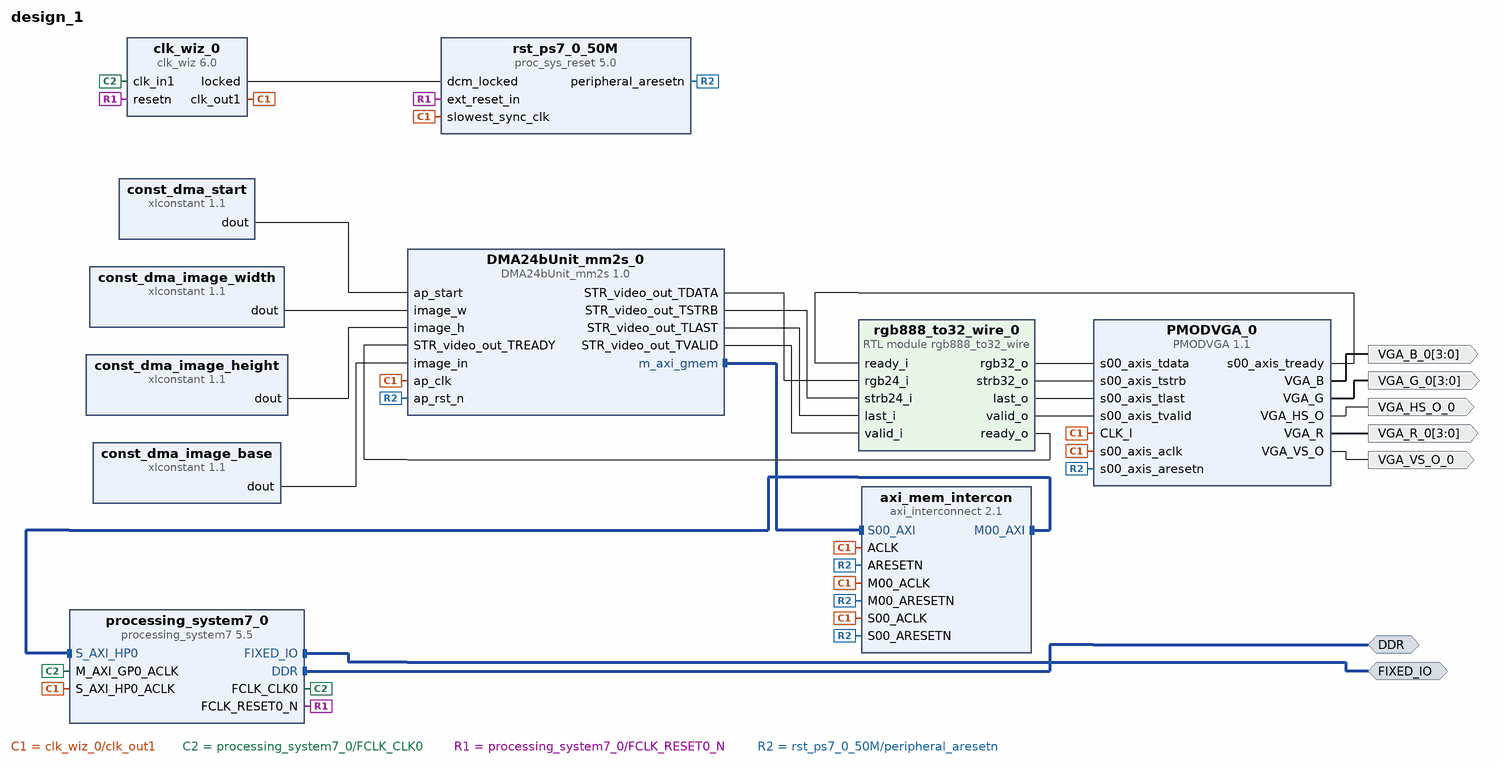
[diagram p0: block diagram of the top level]
# Vivado block design design_1, xc7z010clg400-3, Vivado 2020.2
create_bd_design design_1

create_bd_intf_port -mode Master -vlnv xilinx.com:interface:ddrx_rtl:1.0 DDR
create_bd_intf_port -mode Master -vlnv xilinx.com:display_processing_system7:fixedio_rtl:1.0 FIXED_IO
create_bd_port -dir O -from 3 -to 0 VGA_R_0
create_bd_port -dir O -from 3 -to 0 VGA_B_0
create_bd_port -dir O VGA_VS_O_0
create_bd_port -dir O VGA_HS_O_0
create_bd_port -dir O -from 3 -to 0 VGA_G_0

create_bd_cell -type ip -vlnv xilinx.com:hls:DMA24bUnit_mm2s:1.0 DMA24bUnit_mm2s_0
create_bd_cell -type ip -vlnv xilinx.com:ip:processing_system7:5.5 processing_system7_0
set_property -dict {CONFIG.PCW_CRYSTAL_PERIPHERAL_FREQMHZ 50.000 CONFIG.PCW_USE_S_AXI_HP0 1} [get_bd_cells processing_system7_0]
# 30 more settings of processing_system7_0 are not shown: defaults, MIO pin electricals, DDR timing, and values the tool derives
create_bd_cell -type ip -vlnv xilinx.com:ip:clk_wiz:6.0 clk_wiz_0
set_property -dict [list \
  CONFIG.AUTO_PRIMITIVE MMCM \
  CONFIG.CLKIN1_JITTER_PS 200.0 \
  CONFIG.CLKOUT1_DRIVES BUFG \
  CONFIG.CLKOUT1_JITTER 162.642 \
  CONFIG.CLKOUT1_PHASE_ERROR 141.876 \
  CONFIG.CLKOUT1_REQUESTED_OUT_FREQ 25.175 \
  CONFIG.CLKOUT2_DRIVES BUFG \
  CONFIG.CLKOUT3_DRIVES BUFG \
  CONFIG.CLKOUT4_DRIVES BUFG \
  CONFIG.CLKOUT5_DRIVES BUFG \
  CONFIG.CLKOUT6_DRIVES BUFG \
  CONFIG.CLKOUT7_DRIVES BUFG \
  CONFIG.MMCM_BANDWIDTH OPTIMIZED \
  CONFIG.MMCM_CLKFBOUT_MULT_F 27.125 \
  CONFIG.MMCM_CLKIN1_PERIOD 20.000 \
  CONFIG.MMCM_CLKIN2_PERIOD 10.0 \
  CONFIG.MMCM_CLKOUT0_DIVIDE_F 53.875 \
  CONFIG.MMCM_COMPENSATION INTERNAL \
  CONFIG.MMCM_DIVCLK_DIVIDE 1 \
  CONFIG.OVERRIDE_MMCM true \
  CONFIG.PLL_COMPENSATION SYSTEM_SYNCHRONOUS \
  CONFIG.PRIMITIVE MMCM \
  CONFIG.PRIM_IN_FREQ 50.000 \
  CONFIG.PRIM_IN_TIMEPERIOD 20.000 \
  CONFIG.PRIM_SOURCE No_buffer \
  CONFIG.RESET_PORT resetn \
  CONFIG.RESET_TYPE ACTIVE_LOW \
  CONFIG.USE_LOCKED true \
] [get_bd_cells clk_wiz_0]
create_bd_cell -type ip -vlnv xilinx.com:ip:proc_sys_reset:5.0 rst_ps7_0_50M
create_bd_cell -type ip -vlnv xilinx.com:ip:axi_interconnect:2.1 axi_mem_intercon
set_property -dict {CONFIG.NUM_MI 1} [get_bd_cells axi_mem_intercon]
create_bd_cell -type ip -vlnv xilinx.com:ip:xlconstant:1.1 const_dma_start
set_property -dict {CONFIG.CONST_VAL 1 CONFIG.CONST_WIDTH 1} [get_bd_cells const_dma_start]
create_bd_cell -type ip -vlnv xilinx.com:ip:xlconstant:1.1 const_dma_image_width
set_property -dict {CONFIG.CONST_VAL 640 CONFIG.CONST_WIDTH 12} [get_bd_cells const_dma_image_width]
create_bd_cell -type ip -vlnv xilinx.com:ip:xlconstant:1.1 const_dma_image_height
set_property -dict {CONFIG.CONST_VAL 480 CONFIG.CONST_WIDTH 12} [get_bd_cells const_dma_image_height]
create_bd_cell -type ip -vlnv xilinx.com:ip:xlconstant:1.1 const_dma_image_base
set_property -dict {CONFIG.CONST_VAL 268435456 CONFIG.CONST_WIDTH 64} [get_bd_cells const_dma_image_base]
create_bd_cell -type module -reference rgb888_to32_wire rgb888_to32_wire_0
create_bd_cell -type ip -vlnv xilinx.com:user:PMODVGA:1.1 PMODVGA_0

# ---- connections ----

connect_bd_intf_net [get_bd_intf_pins axi_mem_intercon/M00_AXI] [get_bd_intf_pins processing_system7_0/S_AXI_HP0]
connect_bd_intf_net [get_bd_intf_pins DMA24bUnit_mm2s_0/m_axi_gmem] [get_bd_intf_pins axi_mem_intercon/S00_AXI]
connect_bd_intf_net [get_bd_intf_ports FIXED_IO] [get_bd_intf_pins processing_system7_0/FIXED_IO]
connect_bd_intf_net [get_bd_intf_ports DDR] [get_bd_intf_pins processing_system7_0/DDR]
connect_bd_net [get_bd_pins clk_wiz_0/clk_out1] \
  [get_bd_pins axi_mem_intercon/S00_ACLK] [get_bd_pins axi_mem_intercon/M00_ACLK] [get_bd_pins axi_mem_intercon/ACLK] \
  [get_bd_pins processing_system7_0/S_AXI_HP0_ACLK] [get_bd_pins rst_ps7_0_50M/slowest_sync_clk] \
  [get_bd_pins DMA24bUnit_mm2s_0/ap_clk] [get_bd_pins PMODVGA_0/CLK_I] [get_bd_pins PMODVGA_0/s00_axis_aclk]
connect_bd_net [get_bd_pins processing_system7_0/FCLK_CLK0] [get_bd_pins clk_wiz_0/clk_in1] [get_bd_pins processing_system7_0/M_AXI_GP0_ACLK]
connect_bd_net [get_bd_pins processing_system7_0/FCLK_RESET0_N] [get_bd_pins rst_ps7_0_50M/ext_reset_in] [get_bd_pins clk_wiz_0/resetn]
connect_bd_net [get_bd_pins rst_ps7_0_50M/peripheral_aresetn] \
  [get_bd_pins DMA24bUnit_mm2s_0/ap_rst_n] [get_bd_pins axi_mem_intercon/S00_ARESETN] \
  [get_bd_pins axi_mem_intercon/M00_ARESETN] [get_bd_pins axi_mem_intercon/ARESETN] [get_bd_pins PMODVGA_0/s00_axis_aresetn]
connect_bd_net [get_bd_pins PMODVGA_0/VGA_R] [get_bd_ports VGA_R_0]
connect_bd_net [get_bd_pins PMODVGA_0/VGA_B] [get_bd_ports VGA_B_0]
connect_bd_net [get_bd_pins PMODVGA_0/VGA_VS_O] [get_bd_ports VGA_VS_O_0]
connect_bd_net [get_bd_pins PMODVGA_0/VGA_HS_O] [get_bd_ports VGA_HS_O_0]
connect_bd_net [get_bd_pins PMODVGA_0/VGA_G] [get_bd_ports VGA_G_0]
connect_bd_net [get_bd_pins const_dma_start/dout] [get_bd_pins DMA24bUnit_mm2s_0/ap_start]
connect_bd_net [get_bd_pins const_dma_image_width/dout] [get_bd_pins DMA24bUnit_mm2s_0/image_w]
connect_bd_net [get_bd_pins const_dma_image_height/dout] [get_bd_pins DMA24bUnit_mm2s_0/image_h]
connect_bd_net [get_bd_pins const_dma_image_base/dout] [get_bd_pins DMA24bUnit_mm2s_0/image_in]
connect_bd_net [get_bd_pins DMA24bUnit_mm2s_0/STR_video_out_TDATA] [get_bd_pins rgb888_to32_wire_0/rgb24_i]
connect_bd_net [get_bd_pins DMA24bUnit_mm2s_0/STR_video_out_TSTRB] [get_bd_pins rgb888_to32_wire_0/strb24_i]
connect_bd_net [get_bd_pins DMA24bUnit_mm2s_0/STR_video_out_TLAST] [get_bd_pins rgb888_to32_wire_0/last_i]
connect_bd_net [get_bd_pins DMA24bUnit_mm2s_0/STR_video_out_TVALID] [get_bd_pins rgb888_to32_wire_0/valid_i]
connect_bd_net -net axis_rgb888_to_pmod32_0_s_axis_tready [get_bd_pins rgb888_to32_wire_0/ready_o] \
  [get_bd_pins DMA24bUnit_mm2s_0/STR_video_out_TREADY]
connect_bd_net -net axis_rgb888_to_pmod32_0_m_axis_tdata [get_bd_pins rgb888_to32_wire_0/rgb32_o] [get_bd_pins PMODVGA_0/s00_axis_tdata]
connect_bd_net -net axis_rgb888_to_pmod32_0_m_axis_tstrb [get_bd_pins rgb888_to32_wire_0/strb32_o] [get_bd_pins PMODVGA_0/s00_axis_tstrb]
connect_bd_net -net axis_rgb888_to_pmod32_0_m_axis_tlast [get_bd_pins rgb888_to32_wire_0/last_o] [get_bd_pins PMODVGA_0/s00_axis_tlast]
connect_bd_net -net axis_rgb888_to_pmod32_0_m_axis_tvalid [get_bd_pins rgb888_to32_wire_0/valid_o] [get_bd_pins PMODVGA_0/s00_axis_tvalid]
connect_bd_net [get_bd_pins PMODVGA_0/s00_axis_tready] [get_bd_pins rgb888_to32_wire_0/ready_i]
connect_bd_net [get_bd_pins clk_wiz_0/locked] [get_bd_pins rst_ps7_0_50M/dcm_locked]

# ---- address map ----
assign_bd_address -offset 0x0000000000000000 -range 512M -target_address_space [get_bd_addr_spaces DMA24bUnit_mm2s_0/Data_m_axi_gmem] [get_bd_addr_segs processing_system7_0/S_AXI_HP0/HP0_DDR_LOWOCM]

validate_bd_design
save_bd_design
